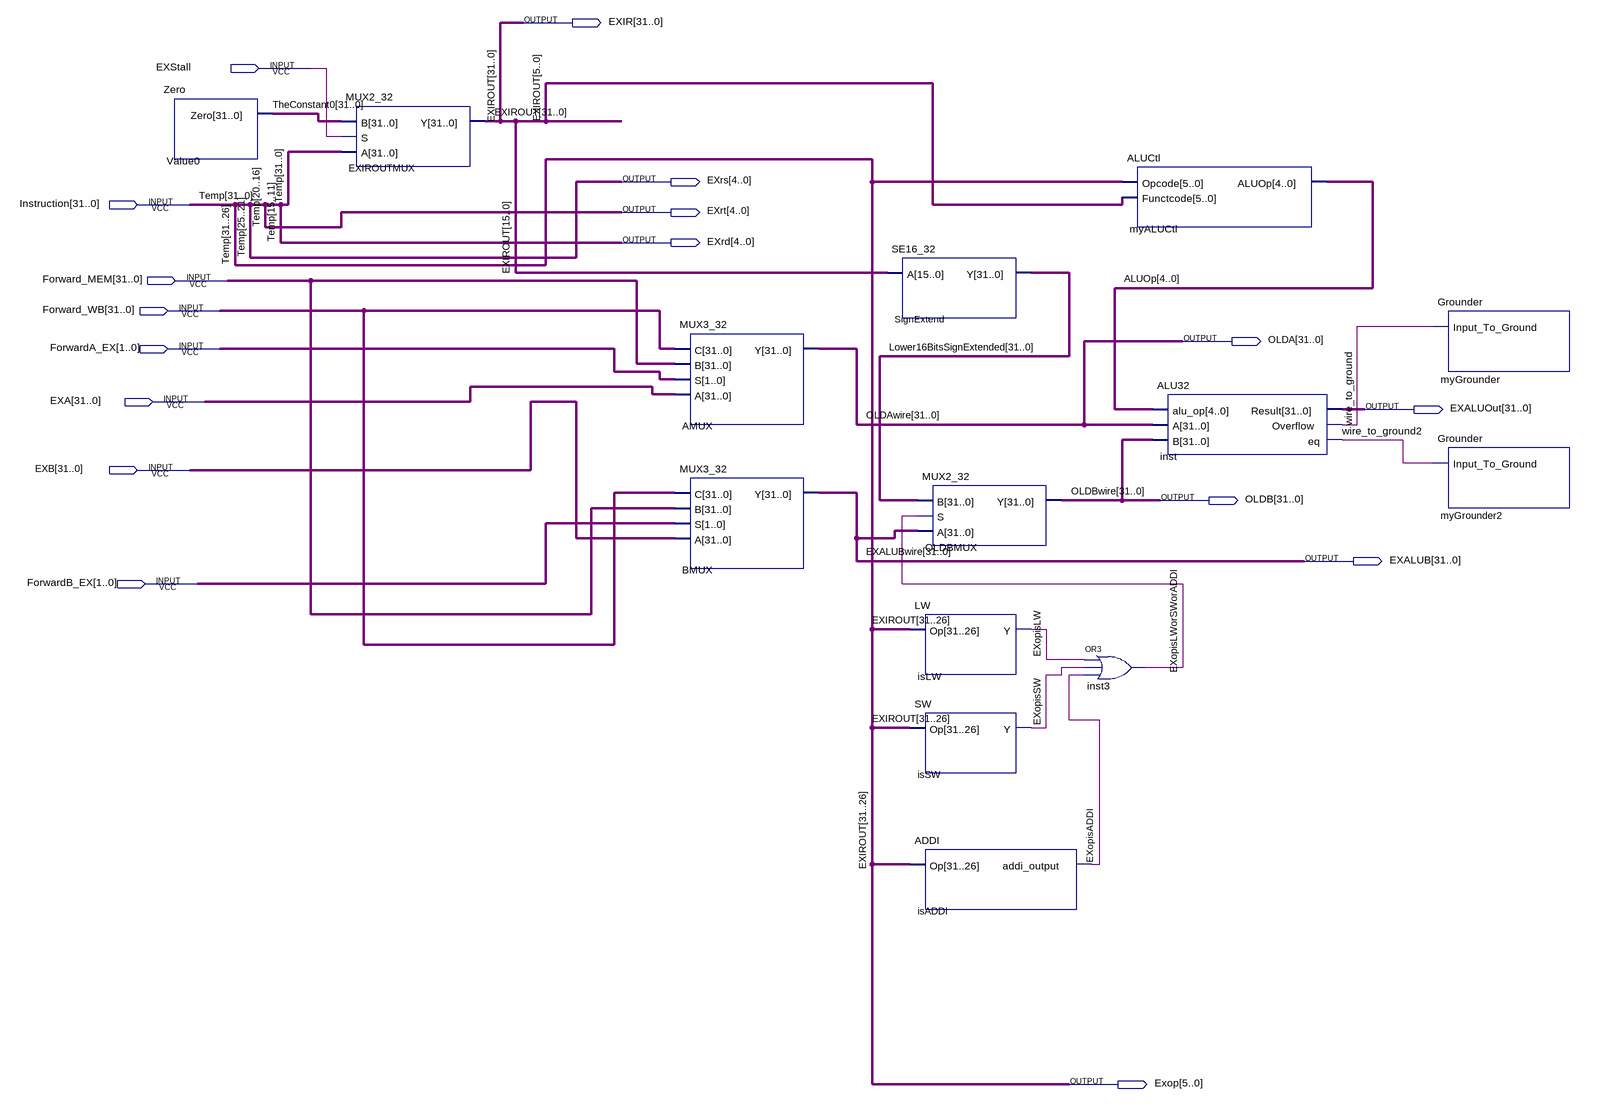
[diagram p0: schematic sheet]
// Quartus schematic EX.bdf as structural Verilog: 14 symbols, 17 pins
module EX (
  input  EXStall,
  input  [31:0] Instruction,
  input  [31:0] Forward_MEM,
  input  [31:0] Forward_WB,
  input  [1:0] ForwardA_EX,
  input  [31:0] EXA,
  input  [31:0] EXB,
  input  [1:0] ForwardB_EX,
  output [31:0] EXIR,
  output [4:0] EXrs,
  output [4:0] EXrt,
  output [4:0] EXrd,
  output [31:0] OLDA,
  output [31:0] EXALUOut,
  output [31:0] OLDB,
  output [31:0] EXALUB,
  output [5:0] Exop
);

  wire EXopisADDI, EXopisLW, EXopisLWorSWorADDI, EXopisSW, wire_to_ground, wire_to_ground2;
  wire [4:0] ALUOp;
  wire [31:0] Lower16BitsSignExtended, TheConstant0;

  Zero Value0 (.Zero(TheConstant0));
  MUX2_32 EXIROUTMUX (.B(TheConstant0), .S(EXStall), .A(Instruction), .Y(EXIR));
  MUX3_32 AMUX (.C(Forward_WB), .B(Forward_MEM), .S(ForwardA_EX), .A(EXA), .Y(OLDA));
  MUX3_32 BMUX (.C(Forward_WB), .B(Forward_MEM), .S(ForwardB_EX), .A(EXB), .Y(EXALUB));
  SE16_32 SignExtend (.A(EXIR[15:0]), .Y(Lower16BitsSignExtended));
  MUX2_32 OLDBMUX (.B(Lower16BitsSignExtended), .S(EXopisLWorSWorADDI), .A(EXALUB), .Y(OLDB));
  LW isLW (.Op(EXIR[31:26]), .Y(EXopisLW));
  SW isSW (.Op(EXIR[31:26]), .Y(EXopisSW));
  ADDI isADDI (.Op(EXIR[31:26]), .addi_output(EXopisADDI));
  or inst3 (EXopisLWorSWorADDI, EXopisLW, EXopisSW, EXopisADDI);
  ALUCtl myALUCtl (.Opcode(Instruction[31:26]), .Functcode(EXIR[5:0]), .ALUOp(ALUOp));
  ALU32 inst (.alu_op(ALUOp), .A(OLDA), .B(OLDB), .Result(EXALUOut), .Overflow(wire_to_ground), .eq(wire_to_ground2));
  Grounder myGrounder (.Input_To_Ground(wire_to_ground));
  Grounder myGrounder2 (.Input_To_Ground(wire_to_ground2));

  assign Exop = EXIR[31:26];
  assign EXrd = Instruction[15:11];
  assign EXrs = Instruction[25:21];
  assign EXrt = Instruction[20:16];

  // Other names for the same wires on the sheet: EXALUBwire[31:0] = EXALUB; EXIROUT[31:0] = EXIR;
  //   Temp[31:0] = Instruction; OLDAwire[31:0] = OLDA; OLDBwire[31:0] = OLDB
endmodule
